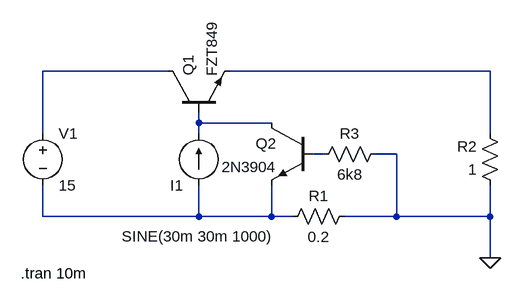
[diagram p0: schematic bjt-protection.asc]
bjt-protection.asc, the LTspice schematic file:
Version 4
SHEET 1 880 680
WIRE 320 -16 128 -16
WIRE 816 -16 416 -16
WIRE 368 64 368 48
WIRE 480 64 368 64
WIRE 128 80 128 -16
WIRE 368 80 368 64
WIRE 816 80 816 -16
WIRE 560 112 544 112
WIRE 672 112 640 112
WIRE 128 208 128 160
WIRE 368 208 368 160
WIRE 368 208 128 208
WIRE 480 208 480 160
WIRE 480 208 368 208
WIRE 512 208 480 208
WIRE 672 208 672 112
WIRE 672 208 592 208
WIRE 816 208 816 160
WIRE 816 208 672 208
WIRE 816 272 816 208
FLAG 816 272 0
SYMBOL voltage 128 64 R0
WINDOW 123 0 0 Left 2
WINDOW 39 0 0 Left 2
SYMATTR InstName V1
SYMATTR Value 15
SYMBOL npn 320 48 R270
SYMATTR InstName Q1
SYMATTR Value FZT849
SYMBOL res 608 192 R90
WINDOW 0 0 56 VBottom 2
WINDOW 3 32 56 VTop 2
SYMATTR InstName R1
SYMATTR Value 0.2
SYMBOL res 832 176 R180
WINDOW 0 36 76 Left 2
WINDOW 3 36 40 Left 2
SYMATTR InstName R2
SYMATTR Value 1
SYMBOL load2 368 160 R180
WINDOW 3 -115 -79 Left 2
WINDOW 123 0 0 Left 2
WINDOW 39 0 0 Left 2
SYMATTR InstName I1
SYMATTR Value SINE(30m 30m 1000)
SYMBOL npn 544 64 M0
SYMATTR InstName Q2
SYMATTR Value 2N3904
SYMBOL res 656 96 R90
WINDOW 0 0 56 VBottom 2
WINDOW 3 32 56 VTop 2
SYMATTR InstName R3
SYMATTR Value 6k8
TEXT 94 296 Left 2 !.tran 10m

The netlist it stands for:
* bjt-protection.asc
V1 N001 N005 15
Q1 N001 N003 N002 0 FZT849
R1 0 N005 0.2
R2 0 N002 1
I1 N005 N003 SINE(30m 30m 1000)
Q2 N003 N004 N005 0 2N3904
R3 0 N004 6k8
.model NPN NPN
.model PNP PNP
.lib standard.bjt
.tran 10m
.backanno
.end